# EAGLE design resonant-bp (EAGLE 7.7.0)
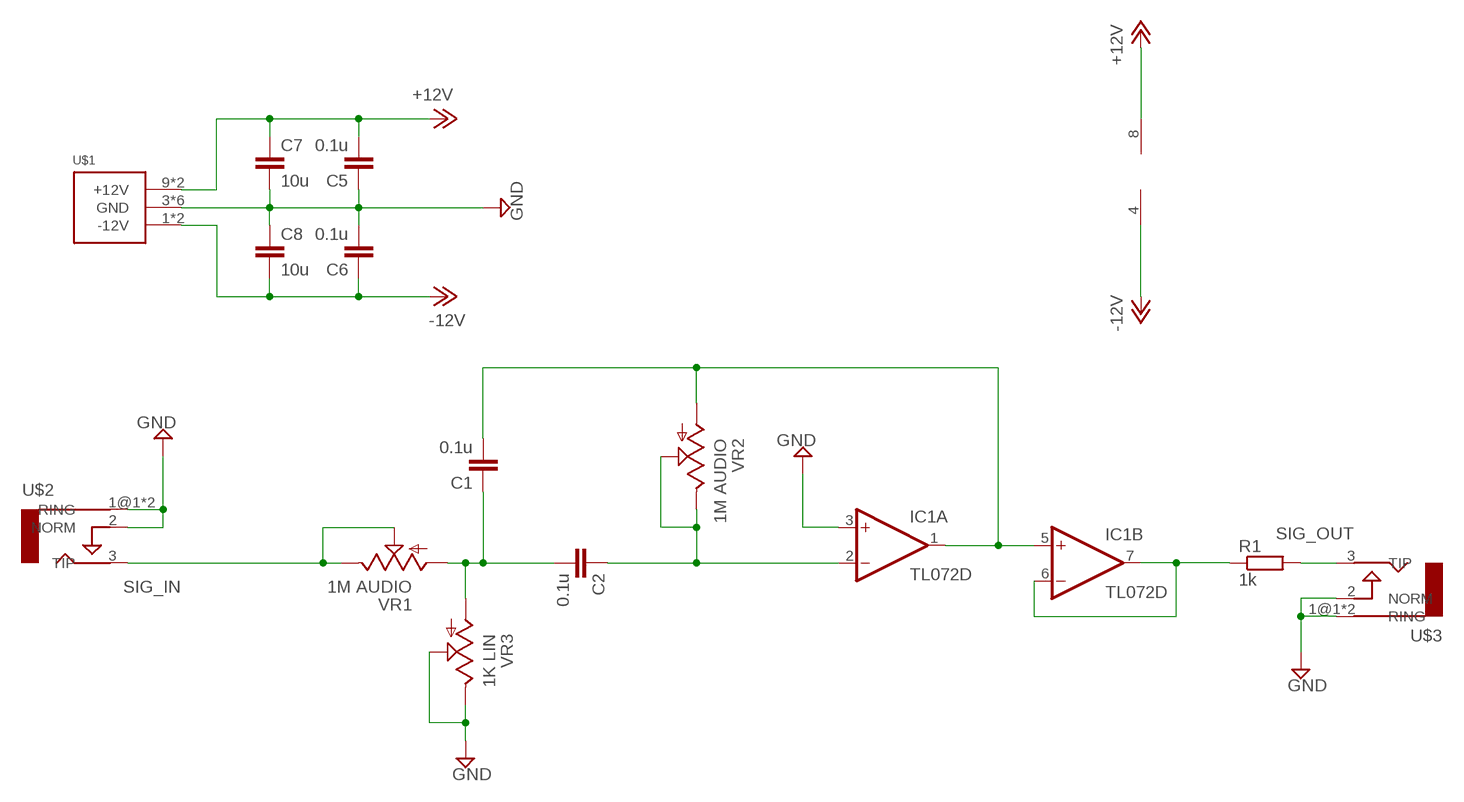
[diagram p0: schematic, sheet 1]

## Parts
C1  0.1u  C-EUC0805  [C0805]
C2  0.1u  C-EUC0805  [C0805]
C5  0.1u  C-EUC0805  [C0805]
C6  0.1u  C-EUC0805  [C0805]
C7  10u  C-EUC0805  [C0805]
C8  10u  C-EUC0805  [C0805]
IC1  TL072D  [SO08]
R1  1k  R-EU_R0805  [R0805]
U$1  POWER_SIMPLE10  [POWER_10]
U$2  AUDIO-JACKERTHENVAR  [ERTHENVAR-JACK]
U$3  AUDIO-JACKERTHENVAR  [ERTHENVAR-JACK]
VR1  1M AUDIO  9MM_SNAP-IN_POT_  [9MM_SNAP-IN_POT]
VR2  1M AUDIO  9MM_SNAP-IN_POT_  [9MM_SNAP-IN_POT]
VR3  1K LIN  9MM_SNAP-IN_POT_  [9MM_SNAP-IN_POT]

## Nets
+12V: C5.2 C7.1 IC1.8(P:V+) U$1.9(+12V) U$1.10(+12V)
-12V: C6.1 C8.2 IC1.4(P:V-) U$1.1(-12V) U$1.2(-12V)
GND: C5.1 C6.2 C7.2 C8.1 IC1.3(A:+IN) U$1.3(GND) U$1.4(GND) U$1.5(GND) U$1.6(GND) U$1.7(GND) U$1.8(GND) U$2.1@1(RING) U$2.1@2(RING) U$2.2(NORM) U$3.1@1(RING) U$3.1@2(RING) U$3.2(NORM) VR3.2(S) VR3.3(E)
N$1: C1.1 C2.2 VR1.1(A) VR3.1(A)
N$4: C1.2 IC1.1(A:OUT) IC1.5(B:+IN) VR2.1(A)
N$5: C2.1 IC1.2(A:-IN) VR2.2(S) VR2.3(E)
N$9: IC1.6(B:-IN) IC1.7(B:OUT) R1.1
SIG_IN: U$2.3(TIP) VR1.2(S) VR1.3(E)
SIG_OUT: R1.2 U$3.3(TIP)

## Library data of the parts
C1 C2 C5-C8 = rcl:C-EU: CAPACITOR, European symbol
IC1 = linear:TL072: OP AMP
R1 = rcl:R-EU_: RESISTOR, European symbol
U$1 = eurorack:POWER_SIMPLE
U$2 U$3 = erthenvar:AUDIO-JACK: Switching Mono 3.5mm Audio Jack from Erthenvar.
VR1-VR3 = MusicThingModular:9MM_SNAP-IN_POT: 9mm vertical snap-in pot, Alpha / Panasonic style

## Board
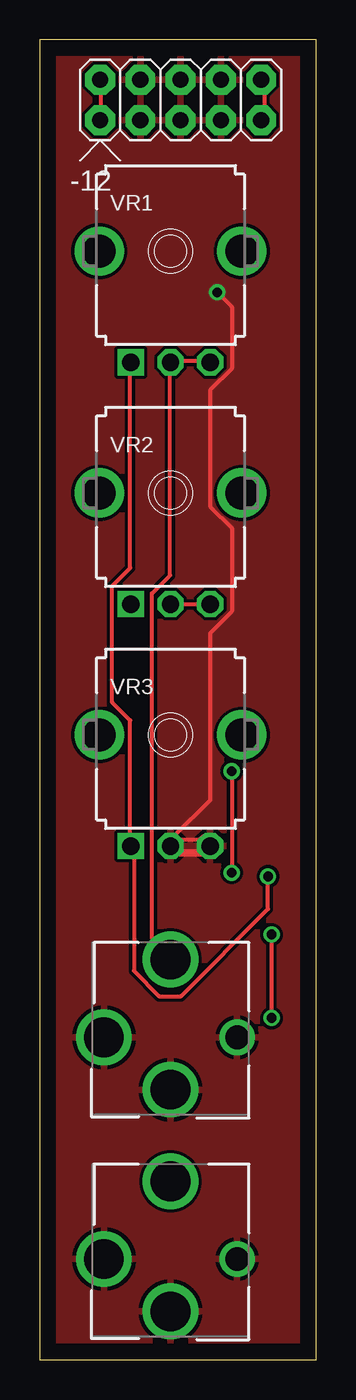
[diagram p1: board, top side]
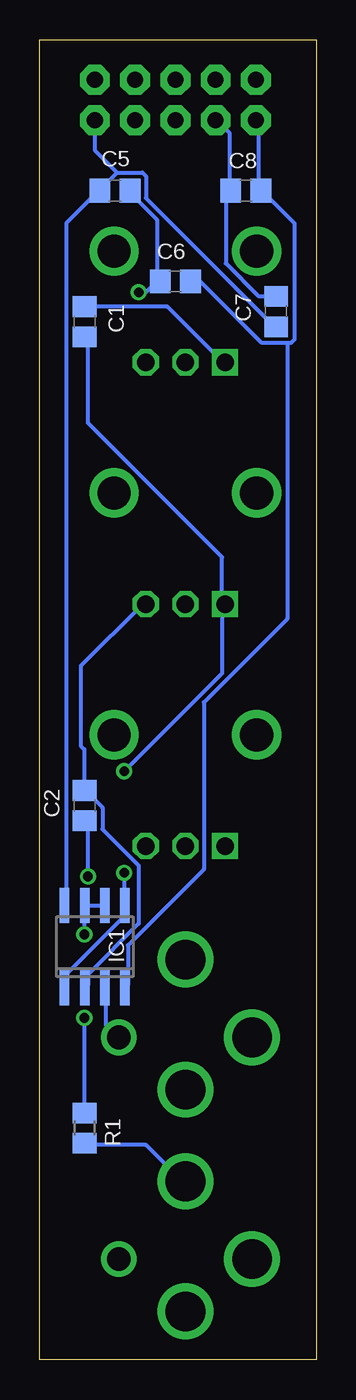
[diagram p2: board, bottom side, seen from below]

Size 17.45 x 83.17 mm. Coordinates in mm from the lower left corner, seen from the top.
Outline: 0,0 17.45,0 17.45,83.17 0,83.17 0,0
Copper layers (1*16): Top 0.035mm / dielectric 1.5mm / Bottom 0.035mm
Design rules "default": minimum track width 10mil, minimum drill 24mil, track to track 8mil, track to pad 8mil, pad to pad 8mil, via to via 8mil, smd to smd 8mil, copper to edge 40mil, drill to drill 8mil, minimum pad ring 10mil, minimum via ring 8mil, stop-mask expansion 4mil, vias tented up to drill 0mil, thermal gap 10mil

### Footprints (pad centres in the part's own frame; a part is rotated, then mirrored left to right if it is on the bottom)
C0805 = smd 1.3 x 1.5: 1 -0.95,0; 2 0.95,0
SO08 = smd 0.6 x 2.2: 1 -1.905,-2.6; 2 -0.635,-2.6; 3 0.635,-2.6; 4 1.905,-2.6; 5 1.905,2.6; 6 0.635,2.6; 7 -0.635,2.6; 8 -1.905,2.6
R0805 = smd 1.3 x 1.5: 1 -0.95,0; 2 0.95,0
POWER_10 = drill 1.016 pad 1.88 octagon: 1 -5.08,-1.27; 2 -5.08,1.27; 3 -2.54,-1.27; 4 -2.54,1.27; 5 0,-1.27; 6 0,1.27; 7 2.54,-1.27; 8 2.54,1.27; 9 5.08,-1.27; 10 5.08,1.27
ERTHENVAR-JACK = drill 2.5: 1@1 -4.2,0; 2 0,-3.3; 3 0,4.9 | drill 1.5: 1@2 4.2,0
9MM_SNAP-IN_POT = drill 1.1 square: 1 -2.5,-7 | drill 1.1 octagon: 2 0,-7; 3 2.5,-7 | drill 2.1 pad 2.794: CHASSIS1 -4.5,0; CHASSIS2 4.5,0

### Placement (x,y rotation side)
C1  14.61,65.41 270 bottom
C2  14.61,34.93 270 bottom
C5  12.7,73.66 180 bottom
C6  8.89,67.94 180 bottom
C7  2.54,66.04 90 bottom
C8  4.45,73.66 0 bottom
IC1  13.97,26.04 0 bottom
R1  14.61,14.61 270 bottom
U$1  8.89,79.38 0 top
U$2  8.26,20.32 0 top
U$3  8.26,6.35 0 top
VR1  8.26,69.85 0 top
VR2  8.26,54.61 0 top
VR3  8.26,39.37 0 top

### Tracks (layer width: path | path; a pad name or v marks a point on that pad's centre or on a via)
+12V
  Top 0.254: U$1.9 14.17,78.23 14.17,80.52 U$1.10
  Bottom 0.254: 12.57,74.8 10.97,74.8 10.74,74.57 10.74,73.2 2.74,65.2 C7.1 | 13.72,73.66 12.57,74.8 | 13.72,73.66 15.77,71.6 15.77,28.85 IC1.8 | 13.72,73.66 C5.2 | 12.57,74.8 13.95,76.17 13.95,78 U$1.9
-12V
  Top 0.254: U$1.2 3.89,80.52 3.89,78.23 U$1.1
  Bottom 0.254: U$1.1 3.66,78 3.66,73.66 C8.2 3.43,73.66 1.37,71.6 1.37,64.29 1.6,64.06 1.83,64.06 | C6.1 7.32,67.94 3.43,64.06 1.83,64.06 | 1.83,64.06 1.83,46.69 7.09,41.43 7.09,30.91 11.89,26.11 11.89,23.6 IC1.4
GND  (via drill 0.61)
  Top 0.254: v11.2,67.26 12.12,66.34 12.12,62.46 10.74,61.09 10.74,53.77 12.12,52.4 12.12,47.14 10.74,45.77 10.74,35.26 8.46,32.97 8.23,32.97 7.77,32.51 7.77,32.05 8,31.83 10.97,31.83 11.43,32.28 11.43,32.51 10.97,32.97 10.29,32.97 10.06,32.74 8.23,32.74 8,32.51 8,32.05 10.97,32.05 11.2,32.28 11.2,32.51 10.97,32.74 10.74,32.74 10.74,32.51 VR3.3
  Bottom 0.254: 5.49,73.66 5.71,73.43 5.71,69.09 3.66,67.03 2.74,67.03 C7.2 | IC1.3 13.26,23.37 13.26,21.08 12.57,20.4 U$2.1@2 | 10.06,67.94 10.06,71.83 11.89,73.66 C5.1 | v11.2,67.26 10.74,67.26 10.06,67.94 | 10.06,67.94 C6.2 | 5.49,73.66 5.49,77.32 6.17,78 U$1.3 | 5.49,73.66 C8.1
  pour Top: 0,83.18 17.78,83.18 17.78,-0.64 0,-0.64
N$1  (via drill 0.61)
  Top 0.254: v14.4,30.45 14.4,28.4 8.91,22.91 7.54,22.91 5.94,24.51 5.94,32.28 VR3.1 5.71,32.51 5.71,40.28 4.57,41.43 4.57,48.74 5.71,49.89 5.71,62.69 VR1.1
  Bottom 0.254: C1.1 14.4,66.34 9.37,66.34 5.94,62.92 VR1.1 | v14.4,30.45 14.4,33.88 C2.2
N$4  (via drill 0.61)
  Top 0.254: v12.12,37.08 v12.12,30.68
  Bottom 0.254: IC1.1 15.77,23.6 15.77,24.28 12.12,27.94 12.12,28.63 IC1.5 12.12,28.85 v12.12,30.68 | C1.2 14.4,64.29 14.4,59.03 5.94,50.57 5.94,47.83 VR2.1 5.94,47.6 5.94,43.26 v12.12,37.08
N$5
  Top 0.254: VR2.2 8.46,47.6 10.74,47.6 VR2.3
  Bottom 0.254: VR2.3 10.97,47.6 14.86,43.71 14.86,38.68 14.63,38.46 14.63,35.94 C2.1 14.4,35.71 13.49,34.8 13.49,33.43 11.2,31.14 11.2,27.48 14.4,24.28 14.4,23.6 IC1.2
N$9  (via drill 0.61)
  Top 0.254: v14.63,26.8 v14.63,21.54
  Bottom 0.254: v14.63,21.54 14.63,15.6 R1.1 | v14.63,26.8 14.63,28.63 IC1.7 14.4,28.63 13.49,28.63 IC1.6
SIG_IN
  Top 0.254: VR1.3 10.74,62.92 8.46,62.92 VR1.2 8.23,62.69 8.23,49.43 7.09,48.29 7.09,26.57 8.23,25.42 U$2.3
SIG_OUT
  Bottom 0.254: R1.2 14.4,13.54 10.74,13.54 8.46,11.25 U$3.3